# Altium schematic sheet Main.SchDoc: *Title
size B; SheetNumber: 1; SheetTotal: 1; Section: Main; Section: Main
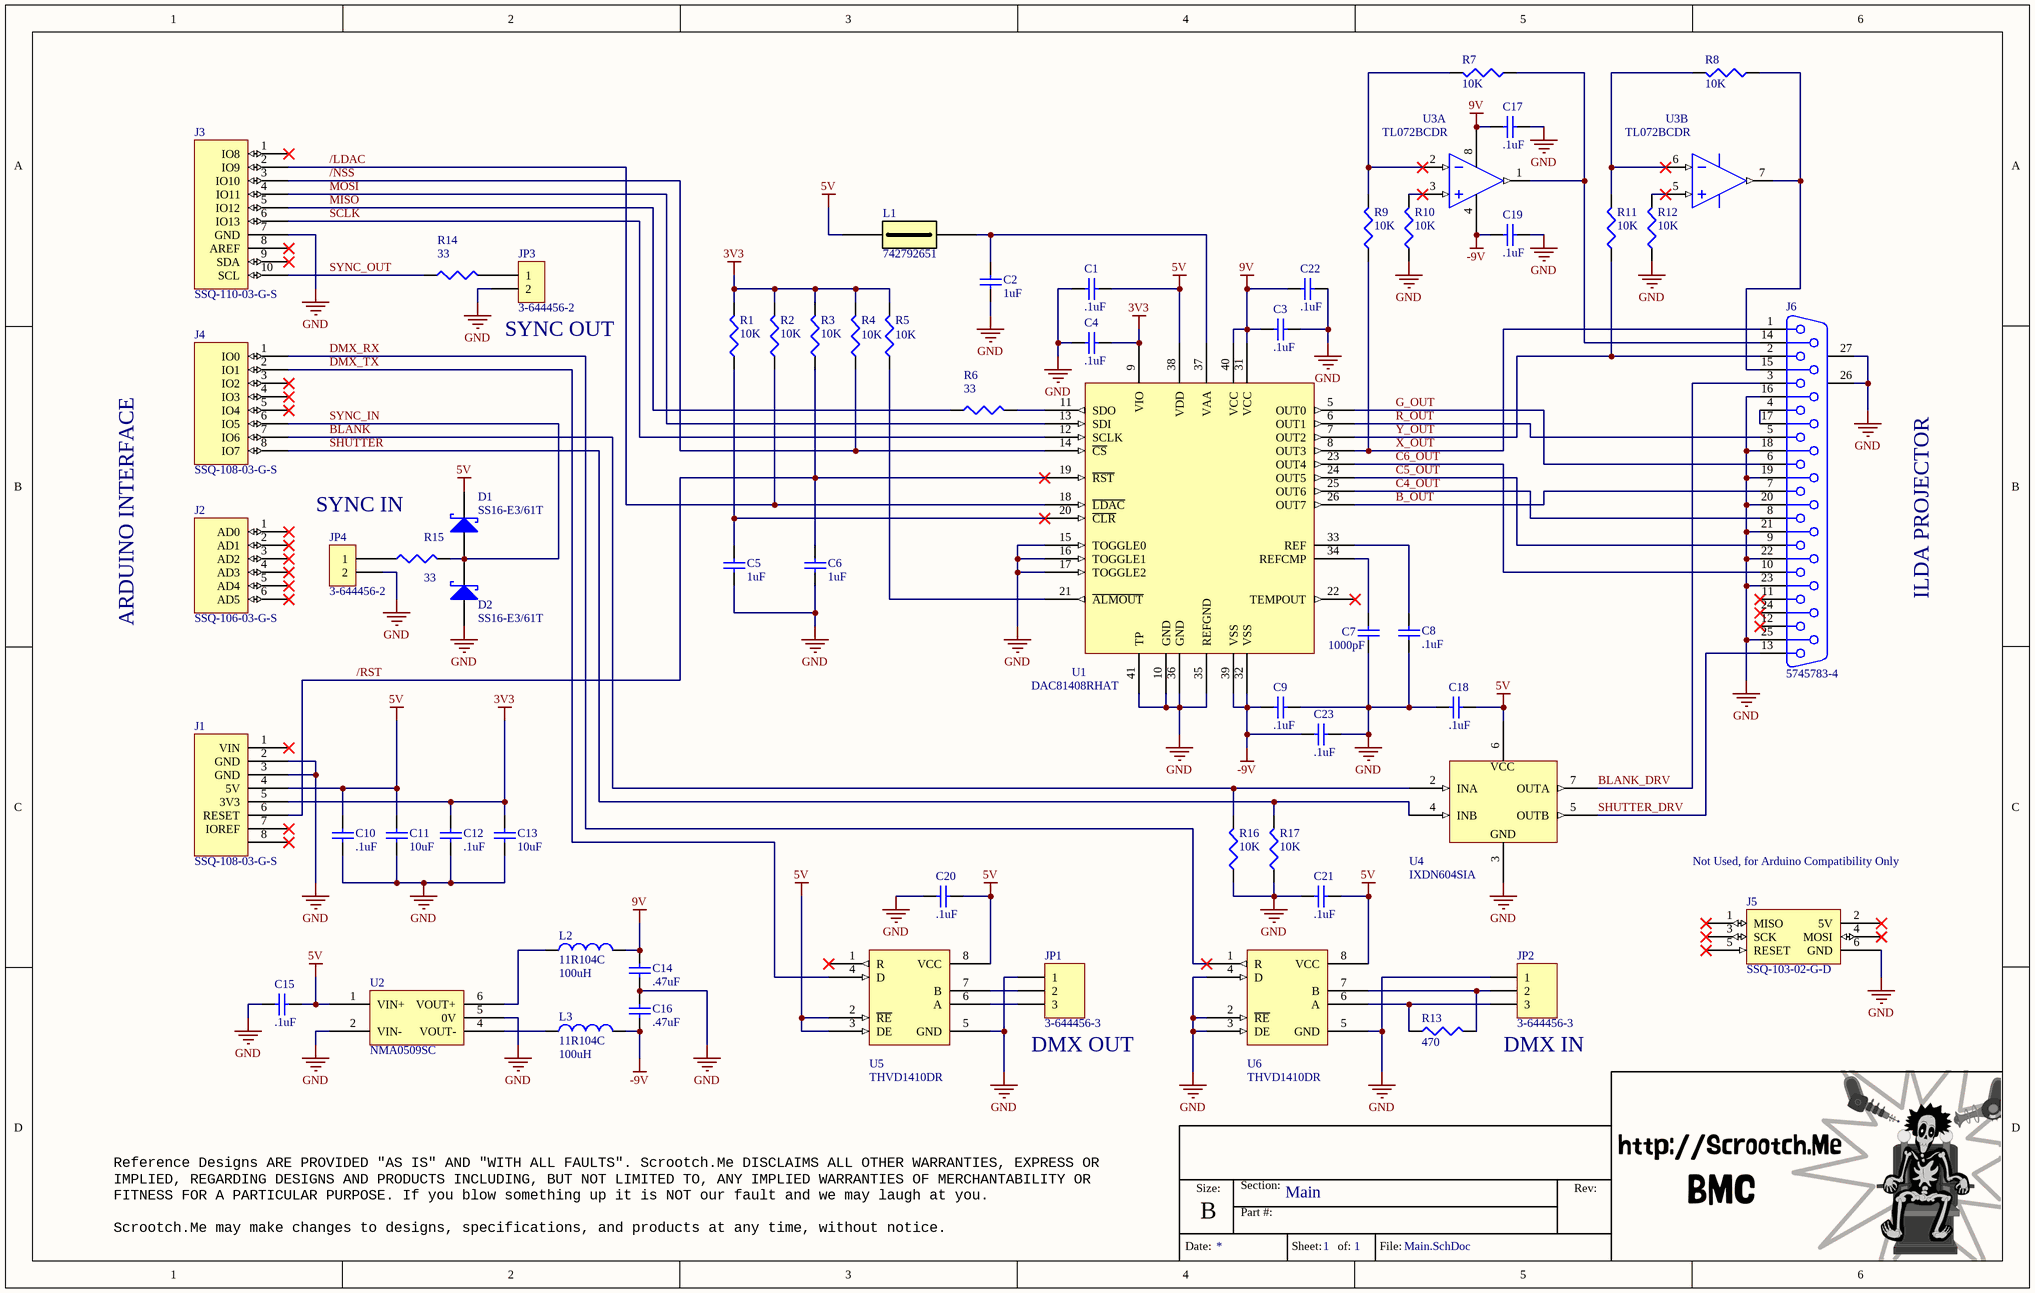
[diagram p0: Main.SchDoc]

## Parts
C1  .1uF  [C0603]
C2  1uF  [C0603]
C3  .1uF  [C0603]
C4  .1uF  [C0603]
C5  1uF  [C0603]
C6  1uF  [C0603]
C7  1000pF  [C0603]
C8  .1uF  [C0603]
C9  .1uF  [C0603]
C10  .1uF  [C0603]
C11  10uF  [C1206]
C12  .1uF  [C0603]
C13  10uF  [C1206]
C14  .47uF  [C0603]
C15  .1uF  [C0603]
C16  .47uF  [C0603]
C17  .1uF  [C0603]
C18  .1uF  [C0603]
C19  .1uF  [C0603]
C20  .1uF  [C0603]
C21  .1uF  [C0603]
C22  .1uF  [C0603]
C23  .1uF  [C0603]
D1  SS16-E3/61T  [SMA]
D2  SS16-E3/61T  [SMA]
J1  SSQ-108-03-G-S  [Header 8x1 8.5mm]
J2  SSQ-106-03-G-S  [Header 6x1 8.5mm]
J3  SSQ-110-03-G-S  [Header 10x1 8.5mm]
J4  SSQ-108-03-G-S  [Header 8x1 8.5mm]
J5  SSQ-103-02-G-D  [ICSP]
J6  5745783-4  [DSUB25F-RA]
JP1  3-644456-3  [HEADER 1x3 100mil]
JP2  3-644456-3  [HEADER 1x3 100mil]
JP3  3-644456-2  [HEADER 1x2 100MIL]
JP4  3-644456-2  [HEADER 1x2 100MIL]
L1  742792651  [R0603]
L2  11R104C  value 100uH  [1100R]
L3  11R104C  value 100uH  [1100R]
R1  10K  [R0603]
R2  10K  [R0603]
R3  10K  [R0603]
R4  10K  [R0603]
R5  10K  [R0603]
R6  33  [R0603]
R7  10K  [R0603]
R8  10K  [R0603]
R9  10K  [R0603]
R10  10K  [R0603]
R11  10K  [R0603]
R12  10K  [R0603]
R13  470  [R0603]
R14  33  [R0603]
R15  33  [R0603]
R16  10K  [R0603]
R17  10K  [R0603]
U1  DAC81408RHAT  [RHA0040H_V]
U2  NMA0509SC  [NMA-SIP]
U3  TL072BCDR  [SOIC8]  (parts A,B of 2)
U4  IXDN604SIA  [SOIC8]
U5  THVD1410DR  [SOIC8]
U6  THVD1410DR  [SOIC8]

## Nets
3V3: C4.1 C12.2 C13.2 J1.5(3V3) R1.2 R2.2 R3.2 R4.2 R5.2 U1.9(VIO)
5V: C1.1 C10.2 C11.2 C15.2 C18.1 C20.1 C21.1 D1.1(K) J1.4(5V) L1.1 U1.38(VDD) U2.1(VIN+) U4.6(VCC) U5.2(~{RE}) U5.3(DE) U5.8(VCC) U6.8(VCC)
9V: C3.2 C14.2 C17.2 C22.2 L2.2 U1.31(VCC) U1.40(VCC) U3.8(VCC+)
-9V: C9.2 C16.1 C19.2 C23.2 L3.2 U1.32(VSS) U1.39(VSS) U3.4(VCC-)
GND: C1.2 C2.1 C3.1 C4.2 C5.1 C6.1 C7.1 C8.1 C9.1 C10.1 C11.1 C12.1 C13.1 C14.1 C15.1 C16.2 C17.1 C18.2 C19.1 C20.2 C21.2 C22.1 C23.1 D2.2(A) J1.2(GND) J1.3(GND) J3.7(GND) J5.6(GND) J6.16 J6.18 J6.19 J6.20 J6.21 J6.22 J6.23 J6.25 J6.26(MH1) J6.27(MH2) JP1.1 JP2.1 JP3.2 JP4.2 R10.1 R12.1 R16.1 R17.1 U1.10(GND) U1.15(TOGGLE0) U1.16(TOGGLE1) U1.17(TOGGLE2) U1.35(REFGND) U1.36(GND) U1.41(TP) U2.2(VIN-) U2.5(0V) U4.3(GND) U5.5(GND) U6.2(~{RE}) U6.3(DE) U6.4(D) U6.5(GND)
/LDAC: J3.2(IO9) R2.1 U1.18(~{LDAC})
/NSS: J3.3(IO10) R4.1 U1.14(~{CS})
/RST: C6.2 J1.6(RESET) R3.1 U1.19(~{RST})
B_OUT: J6.7 U1.26(OUT7)
BLANK: J4.7(IO6) R16.2 U4.2(INA)
BLANK_DRV: J6.3 U4.7(OUTA)
C4_OUT: J6.8 U1.25(OUT6)
C5_OUT: J6.9 U1.24(OUT5)
C6_OUT: J6.10 U1.23(OUT4)
DMX_RX: J4.1(IO0) U6.1(R)
DMX_TX: J4.2(IO1) U5.4(D)
G_OUT: J6.6 U1.5(OUT0)
MISO: J3.5(IO12) R6.1
MOSI: J3.4(IO11) U1.13(SDI)
R_OUT: J6.5 U1.6(OUT1)
SCLK: J3.6(IO13) U1.12(SCLK)
SHUTTER: J4.8(IO7) R17.2 U4.4(INB)
SHUTTER_DRV: J6.13 U4.5(OUTB)
SYNC_IN: D1.2(A) D2.1(K) J4.6(IO5) R15.2
SYNC_OUT: J3.10(SCL) R14.1
X_OUT: J6.1 R9.1 U1.8(OUT3)
Y_OUT: J6.2 R11.1 U1.7(OUT2)
NetC2_2: C2.2 L1.2 U1.37(VAA)
NetC5_2: C5.2 R1.1 U1.20(~{CLR})
NetC7_2: C7.2 U1.34(REFCMP)
NetC8_2: C8.2 U1.33(REF)
NetJ6_4: J6.4 J6.17
NetJ6_14: J6.14 R7.1 U3.1(OUT1)
NetJ6_15: J6.15 R8.1 U3.7(OUT2)
NetJP1_2: JP1.2 U5.7(B)
NetJP1_3: JP1.3 U5.6(A)
NetJP2_2: JP2.2 R13.2 U6.7(B)
NetJP2_3: JP2.3 R13.1 U6.6(A)
NetJP3_1: JP3.1 R14.2
NetJP4_1: JP4.1 R15.1
NetL2_1: L2.1 U2.6(VOUT+)
NetL3_1: L3.1 U2.4(VOUT-)
NetR5_1: R5.1 U1.21(~{ALMOUT})
NetR6_2: R6.2 U1.11(SDO)
NetR7_2: R7.2 R9.2 U3.2(IN1-)
NetR8_2: R8.2 R11.2 U3.6(IN2-)
NetR10_2: R10.2 U3.3(IN1+)
NetR12_2: R12.2 U3.5(IN2+)

Not connected (* = marked no-connect by the designer): J1 1(VIN)* 7(IOREF)* 8*; J2 1(AD0)* 2(AD1)* 3(AD2)* 4(AD3)* 5(AD4)* 6(AD5)*; J3 1(IO8)* 8(AREF)* 9(SDA)*; J4 3(IO2)* 4(IO3)* 5(IO4)*; J5 1(MISO)* 2(5V)* 3(SCK)* 4(MOSI)* 5(RESET)*; J6 11* 12* 24*; U1 22(TEMPOUT)*; U5 1(R)*

## Notes on the sheet
- (near JP3) SYNC OUT
- SYNC IN
- ARDUINO INTERFACE
- ILDA PROJECTOR
- Not Used, for Arduino Compatibility Only
- (near JP1) DMX OUT
- DMX IN
- Reference Designs ARE PROVIDED "AS IS" AND "WITH ALL FAULTS". Scrootch.Me DISCLAIMS ALL OTHER WARRANTIES, EXPRESS OR IMPLIED, REGARDING DESIGNS AND PRODUCTS INCLUDING, BUT NOT LIMITED TO, ANY IMPLIED WARRANTIES OF MERCHANTABILITY OR FITNESS FOR A PARTICULAR PURPOSE. If you blow something up it is NOT our fault and we may laugh at you.
  Scrootch.Me may make changes to designs, specifications, and products at any time, without notice.
- Size:
- B
- Part #:
- Section:
- Rev:
- Date:
- Sheet:
- of:
- File:

## Library data of the parts
C1 C3 C4 C8-C10 C12 C15 C17-C23 = CAP_CER_0.1UF_50V_X7R_0603: 0.1µF ±10% 50V Ceramic Capacitor X7R 0603 (1608 Metric); Value: .1uF; Supplier 1: Digi-Key; Supplier Part Number 1: 399-5089-1-ND; ComponentLink1Description: Datasheet; ComponentLink1URL: https://content.kemet.com/datasheets/KEM_C1002_X7R_SMD.pdf
C2 C5 C6 = CAP_CER_1UF_25V_X7R_0603: 1µF ±10% 25V Ceramic Capacitor X7R 0603 (1608 Metric); Value: 1uF; ComponentLink1Description: Datasheet; ComponentLink1URL: https://api.kemet.com/component-edge/download/datasheet/C0603C105K3RACTU.pdf; Supplier 1: Digi-Key; Supplier Part Number 1: 399-7376-1-ND
C7 = CAP_CER_1000PF_50V_X7R_0603: 1000pF ±10% 50V Ceramic Capacitor X7R 0603 (1608 Metric); Value: 1000pF; Supplier 1: Digi-Key; Supplier Part Number 1: 399-1082-1-ND; ComponentLink1Description: Datasheet; ComponentLink1URL: https://api.kemet.com/component-edge/download/datasheet/C0603C105K3RACTU.pdf
C11 C13 = CAP_CER_10UF_50V_X5R_1206: 10µF ±10% 50V Ceramic Capacitor X5R 1206 (3216 Metric); Value: 10uF; ComponentLink1URL: http://weblib.samsungsem.com/mlcc/mlcc-ec-data-sheet.do?partNumber=CL31A106KBHNNN; ComponentLink1Description: http://www.samsungsem.com/kr/front/downloadcms.do?path=/kr/support/product-search/mlcc/__icsFiles/afieldfile/2015/04/16&fileName=CL31A106KBHNNNE.pdf; Supplier 1: Digi-Key; Supplier Part Number 1: 1276-2876-1-ND
C14 C16 = CAP_CER_0.47UF_25V_X5R_0805: 0.47µF ±10% 25V Ceramic Capacitor X5R 0805 (2012 Metric); Value: .47uF; ComponentLink1Description: Datasheet; ComponentLink1URL: https://ds.yuden.co.jp/TYCOMPAS/ut/detail?pn=TMK212BJ474KD-T%20%20&u=M; Supplier 1: Digi-Key; Supplier Part Number 1: 587-1290-1-ND
D1 D2 = DIODE_SCHOTTKY_SS16-E3/61T: Diode Schottky 60V 1A Surface Mount DO-214AC (SMA); ComponentLink1Description: Datasheet; ComponentLink1URL: https://www.vishay.com/docs/88746/ss12.pdf; Supplier 1: Digi-Key; Supplier Part Number 1: SS16-E3/61TGICT-ND
J1 = CONN_UNO-POWER: 8 Position Receptacle Connector , .1", Gold, Through Hole; Supplier 1: Digi-Key; Supplier Part Number 1: SAM1198-08-ND; ComponentLink1Description: Datasheet; ComponentLink1URL: http://suddendocs.samtec.com/catalog_english/ssq_th.pdf
J2 = CONN_UNO-AD: 6 Position Receptacle Connector, .1", Gold, Through Hole; Supplier 1: Digi-Key; Supplier Part Number 1: SAM1198-06-ND; ComponentLink1Description: Datasheet; ComponentLink1URL: http://suddendocs.samtec.com/catalog_english/ssq_th.pdf
J3 = CONN_UNO-IOH: 10 Position Receptacle Connector, .1", Gold, Through Hole; Supplier 1: Digi-Key; Supplier Part Number 1: SAM1198-10-ND; ComponentLink1Description: Datasheet; ComponentLink1URL: http://suddendocs.samtec.com/catalog_english/ssq_th.pdf
J4 = CONN_UNO-IOL: 8 Position Receptacle Connector , .1", Gold, Through Hole; Supplier 1: Digi-Key; Supplier Part Number 1: SAM1198-08-ND; ComponentLink1Description: Datasheet; ComponentLink1URL: http://suddendocs.samtec.com/catalog_english/ssq_th.pdf
J5 = CONN_UNO-ICSP: 6 Position (2x3) Receptacle Connector, .1", Gold, Through Hole; Supplier 1: Digi-Key; Supplier Part Number 1: SAM1185-03-ND
J6 = CONN_DSUB25F-RA: 25 Position D-Sub Receptacle, Female Sockets Connector; Supplier 1: Digi-Key; Supplier Part Number 1: A32077-ND; ComponentLink1Description: Drawing; ComponentLink1URL: https://www.te.com/commerce/DocumentDelivery/DDEController?Action=srchrtrv&DocNm=5745783&DocType=Customer+Drawing&DocLang=English
JP1 JP2 = CONN_HEADER_VERT_3POS_2.54MM: Connector Header Through Hole 3 position 0.100" (2.54mm); ComponentLink1URL: http://documents.tycoelectronics.com/commerce/DocumentDelivery/DDEController?Action=srchrtrv&DocNm=644456&DocType=CD&DocLang=EN; ComponentLink1Description: Datasheet; ComponentLink2URL: http://www.te.com/catalog/products/en?q=3-644456-3; ComponentLink3URL: http://www.te.com; ComponentLink2Description: Product Page; ComponentLink3Description: TE Connectivity Home; Supplier 1: Digi-Key; Supplier Part Number 1: A31113-ND
JP3 JP4 = CONN_HEADER_VERT_2POS_2.54MM: Connector Header Through Hole 2 position 0.100" (2.54mm); ComponentLink1URL: http://documents.tycoelectronics.com/commerce/DocumentDelivery/DDEController?Action=srchrtrv&DocNm=644456&DocType=CD&DocLang=EN; ComponentLink1Description: Datasheet; ComponentLink2URL: http://www.te.com/catalog/products/en?q=3-644456-2; ComponentLink3URL: http://www.te.com; ComponentLink2Description: Product Page; ComponentLink3Description: TE Connectivity Home; Supplier 1: Digi-Key; Supplier Part Number 1: A31112-ND
L1 = IND_742792651: 600 Ohms @ 100MHz 1 Signal Line Ferrite Bead 0603 (1608 Metric) 1A 200mOhm; ComponentLink1Description: Datasheet; ComponentLink1URL: https://katalog.we-online.de/pbs/datasheet/742792651.pdf; Supplier 1: Digi-Key; Supplier Part Number 1: 732-1593-1-ND
L2 L3 = IND_11R104C: 100µH Unshielded Wirewound Inductor 350mA 1.1Ohm Max Radial, Vertical Cylinder; ComponentLink1Description: Datasheet; ComponentLink1URL: https://www.murata-ps.com/pub/data/magnetics/kmp_1100r.pdf; Supplier 1: Digi-Key; Supplier Part Number 1: 811-2030-ND
R1-R5 R7-R12 R16 R17 = RES_SMD_10K_OHM_1P_.1W_0603: 10 kOhms ±1% 0.1W, 1/10W Chip Resistor 0603 (1608 Metric) Automotive AEC-Q200 Thick Film; Value: 10K; Supplier 1: Digi-Key; ComponentLink1Description: Datasheet; ComponentLink1URL: https://industrial.panasonic.com/cdbs/www-data/pdf/RDA0000/AOA0000C304.pdf; Supplier Part Number 1: P10.0KHCT-ND
R6 R14 R15 = RES_SMD_33_OHM_1P_.1W_0603: 33 Ohms ±1% 0.1W, 1/10W Chip Resistor 0603 (1608 Metric) Automotive AEC-Q200 Thick Film; Value: 33; ComponentLink1Description: Datasheet; ComponentLink1URL: http://www.vishay.com/docs/20035/dcrcwe3.pdf; Supplier 1: Digi-Key; Supplier Part Number 1: 541-CRCW060333R0FKEBCT-ND
R13 = RES_SMD_470_OHM_1P_.1W_0603: 470 Ohms ±1% 0.1W, 1/10W Chip Resistor 0603 (1608 Metric) Automotive AEC-Q200 Thick Film; Value: 470; ComponentLink1Description: Datasheet; ComponentLink1URL: https://industrial.panasonic.com/cdbs/www-data/pdf/RDA0000/AOA0000C304.pdf; Supplier 1: Digi-Key; Supplier Part Number 1: P470HCT-ND
U1 = IC_DAC_DAC81408RHAT: 16 Bit Digital to Analog Converter 8 channel 40-VQFN (6x6); Supplier 1: Digi-Key; Supplier Part Number 1: 296-53466-1-ND; ComponentLink1Description: Datasheet; ComponentLink1URL: https://www.ti.com/lit/ds/symlink/dac81408.pdf?ts=1592954158216&ref_url=https%253A%252F%252Fwww.ti.com%252Fproduct%252FDAC81408
U2 = REG_NMA0509SC: Isolated Module DC DC Converter 2 Output 9V -9V   55mA, 55mA 4.5V - 5.5V Input; ComponentLink1Description: Datasheet; ComponentLink1URL: https://www.murata.com/products/productdata/8807031013406/kdc-nma.pdf?1583754812000; Supplier 1: Digi-Key; Supplier Part Number 1: 811-1449-5-ND
U3 = IC_OPAMP_JFET_2 CH_8SOIC: J-FET Amplifier 2 Circuit  8-SOIC; ComponentLink1URL: http://www.ti.com/; ComponentLink3Description: Package Specification; ComponentLink2Description: Datasheet; ComponentLink3URL: http://www.ti.com/litv/pdf/msoi002j; ComponentLink1Description: Manufacturer URL; ComponentLink2URL: http://www.ti.com/lit/ds/symlink/tl072b.pdf; Supplier 1: Digi-Key; Supplier Part Number 1: 296-14996-1-ND
U4 = IC_DRVR_IXDN604SIA: Low-Side Gate Driver IC Non-Inverting 8-SOIC; ComponentLink1Description: Datasheet; ComponentLink1URL: http://www.ixysic.com/home/pdfs.nsf/www/IXD_604.pdf/$file/IXD_604.pdf; Supplier 1: Digi-Key; Supplier Part Number 1: 212-IXDN604SIACT-ND
U5 U6 = IC_TRANS_THVD1410DR: Transceiver 1ch Half RS485 8-SOIC; Supplier 1: Digi-Key; Supplier Part Number 1: 296-THVD1410DRCT-ND; ComponentLink1Description: Datasheet; ComponentLink1URL: https://www.ti.com/lit/ds/symlink/thvd1410.pdf?HQS=TI-null-null-digikeymode-df-pf-null-wwe&ts=1593548093817